# Altium schematic sheet 4_cyber60-smk_periferals.SchDoc: =ProjectTitle
size A4; Address1: github.com/4pplet/cyber60; Address2: Licence: CERN-OHL-S; SheetNumber: 5; SheetTotal: 5
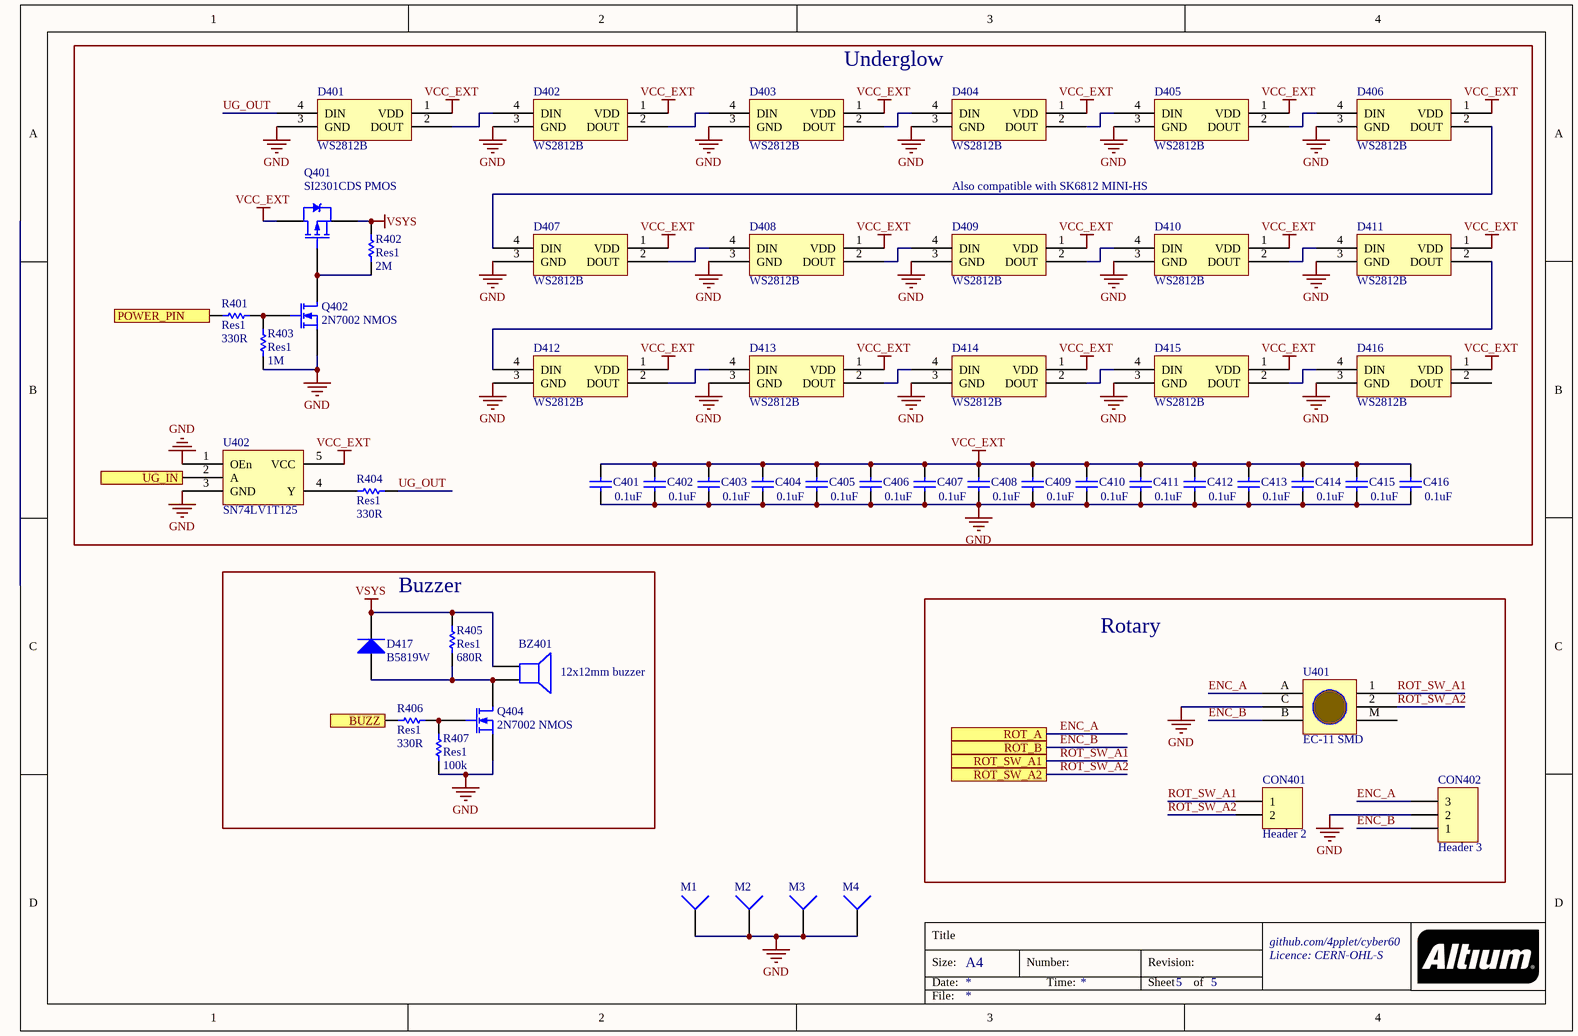
[diagram p0: 4_cyber60-smk_periferals.SchDoc]

## Parts
BZ401  12x12mm buzzer  [buzzer 12x12]
C401  value 0.1uF  [C0603[1608]]
C402  value 0.1uF  [C0603[1608]]
C403  value 0.1uF  [C0603[1608]]
C404  value 0.1uF  [C0603[1608]]
C405  value 0.1uF  [C0603[1608]]
C406  value 0.1uF  [C0603[1608]]
C407  value 0.1uF  [C0603[1608]]
C408  value 0.1uF  [C0603[1608]]
C409  value 0.1uF  [C0603[1608]]
C410  value 0.1uF  [C0603[1608]]
C411  value 0.1uF  [C0603[1608]]
C412  value 0.1uF  [C0603[1608]]
C413  value 0.1uF  [C0603[1608]]
C414  value 0.1uF  [C0603[1608]]
C415  value 0.1uF  [C0603[1608]]
C416  value 0.1uF  [C0603[1608]]
CON401  Header 2  [HDR1X2]  (no BOM)
CON402  Header 3  [HDR1X3]  (no BOM)
D401  WS2812B  [WS2812B - 2020]
D402  WS2812B  [WS2812B - 2020]
D403  WS2812B  [WS2812B - 2020]
D404  WS2812B  [WS2812B - 2020]
D405  WS2812B  [WS2812B - 2020]
D406  WS2812B  [WS2812B - 2020]
D407  WS2812B  [WS2812B - 2020]
D408  WS2812B  [WS2812B - 2020]
D409  WS2812B  [WS2812B - 2020]
D410  WS2812B  [WS2812B - 2020]
D411  WS2812B  [WS2812B - 2020]
D412  WS2812B  [WS2812B - 2020]
D413  WS2812B  [WS2812B - 2020]
D414  WS2812B  [WS2812B - 2020]
D415  WS2812B  [WS2812B - 2020]
D416  WS2812B  [WS2812B - 2020]
D417  B5819W  [SOD-123]
M1  Socket  [mounting_hole]  (value not drawn)  (no BOM)
M2  Socket  [mounting_hole]  (value not drawn)  (no BOM)
M3  Socket  [mounting_hole]  (value not drawn)  (no BOM)
M4  Socket  [mounting_hole]  (value not drawn)  (no BOM)
Q401  SI2301CDS PMOS  [SOT-23-3]
Q402  2N7002 NMOS  [SOT-23-3]
Q404  2N7002 NMOS  [SOT-23-3]
R401  Res1  value 330R  [R0603[1608]]
R402  Res1  value 2M  [R0603[1608]]
R403  Res1  value 1M  [R0603[1608]]
R404  Res1  value 330R  [R0603[1608]]
R405  Res1  value 680R  [R0603[1608]]
R406  Res1  value 330R  [R0603[1608]]
R407  Res1  value 100k  [R0603[1608]]
U401  EC-11 SMD  [EC11-SMD]
U402  SN74LV1T125  [SOT-23-5]

## Blocks framed on the sheet
Underglow: C401-C416 D401-D416 Q401 Q402 R401-R404 U402
Buzzer: BZ401 D417 Q404 R405-R407
Rotary: CON401 CON402 U401

## Ports
BUZZ, POWER_PIN, ROT_A, ROT_B, ROT_SW_A1, ROT_SW_A2, UG_IN

## Nets
GND: C401.1 C402.1 C403.1 C404.1 C405.1 C406.1 C407.1 C408.1 C409.1 C410.1 C411.1 C412.1 C413.1 C414.1 C415.1 C416.1 CON402.2 D401.3(GND) D402.3(GND) D403.3(GND) D404.3(GND) D405.3(GND) D406.3(GND) D407.3(GND) D408.3(GND) D409.3(GND) D410.3(GND) D411.3(GND) D412.3(GND) D413.3(GND) D414.3(GND) D415.3(GND) D416.3(GND) M1.1 M2.1 M3.1 M4.1 Q402.2(S) Q404.2(S) R403.2 R407.2 U401.C U402.1(OEn) U402.3(GND)
VCC_EXT: C401.2 C402.2 C403.2 C404.2 C405.2 C406.2 C407.2 C408.2 C409.2 C410.2 C411.2 C412.2 C413.2 C414.2 C415.2 C416.2 D401.1(VDD) D402.1(VDD) D403.1(VDD) D404.1(VDD) D405.1(VDD) D406.1(VDD) D407.1(VDD) D408.1(VDD) D409.1(VDD) D410.1(VDD) D411.1(VDD) D412.1(VDD) D413.1(VDD) D414.1(VDD) D415.1(VDD) D416.1(VDD) Q401.3(D) U402.5(VCC)
VSYS: BZ401.1 D417.2(K) Q401.2(S) R402.2 R405.1
BUZZ: R406.2 ; port BUZZ
ENC_A: CON402.3 U401.A(B) ; port ROT_A
ENC_B: CON402.1 U401.B ; port ROT_B
POWER_PIN: R401.1 ; port POWER_PIN
ROT_SW_A1: CON401.1 U401.1 ; port ROT_SW_A1
ROT_SW_A2: CON401.2 U401.2 ; port ROT_SW_A2
UG_IN: U402.2(A) ; port UG_IN
UG_OUT: D401.4(DIN) R404.1
NetBZ401_2: BZ401.2 D417.1(A) Q404.3(D) R405.2
NetD401_2: D401.2(DOUT) D402.4(DIN)
NetD402_2: D402.2(DOUT) D403.4(DIN)
NetD403_2: D403.2(DOUT) D404.4(DIN)
NetD404_2: D404.2(DOUT) D405.4(DIN)
NetD405_2: D405.2(DOUT) D406.4(DIN)
NetD406_2: D406.2(DOUT) D407.4(DIN)
NetD407_2: D407.2(DOUT) D408.4(DIN)
NetD408_2: D408.2(DOUT) D409.4(DIN)
NetD409_2: D409.2(DOUT) D410.4(DIN)
NetD410_2: D410.2(DOUT) D411.4(DIN)
NetD411_2: D411.2(DOUT) D412.4(DIN)
NetD412_2: D412.2(DOUT) D413.4(DIN)
NetD413_2: D413.2(DOUT) D414.4(DIN)
NetD414_2: D414.2(DOUT) D415.4(DIN)
NetD415_2: D415.2(DOUT) D416.4(DIN)
NetQ401_1: Q401.1(G) Q402.3(D) R402.1
NetQ402_1: Q402.1(G) R401.2 R403.1
NetQ404_1: Q404.1(G) R406.1 R407.1
NetR404_2: R404.2 U402.4(Y)

Not connected (* = marked no-connect by the designer): D416 2(DOUT); U401 M

## Notes on the sheet
- Also compatible with SK6812 MINI-HS
- Title
- Size:
- Date:
- A4
- Number:
- Time:
- Revision:
- Sheet
- of
- File:

## Library data of the parts
BZ401 = Speaker: Loudspeaker; MRF.Part: YS-SBZ1230; LCSC MFG: Fengming; LCSC Part #: C409829
C401-C416 = Cap: Capacitor; MRF.Part: CC0603KRX7R9BB104; MFG: KEMET; MFGPN: C0603C104M5RACTU; LCSC MFG: YAGEO; Version: 0603 imperial; LCSC Part #: C14663
CON401 = Header 2: Header, 2-Pin
CON402 = Header 3: Header, 3-Pin
D401-D416 = WS2812B: MRF.Part: WS2812C-2020; LCSC MFG: Worldsemi; LCSC Part #: C965556
D417 = Diode: Default Diode; LCSC MFG: Changjiang Electronics Tech (CJ); Version: SOD-123; LCSC Part #: C8598; MRF.Part: B5819W
Q401 = PMOS-2: P-Channel Power MOSFET; MRF.Part: SI2301CDS-T1-GE3; Note: Pin 4 not drawn and electrically connected to Pin 2.; LCSC MFG: Vishay Intertech; LCSC Part #: C10487
Q402 Q404 = MOSFET-N: N-Channel MOSFET; LCSC MFG: Changjiang Electronics Tech (CJ); LCSC Part #: C8545; MRF.Part: 2N7002
R401 R404 R406 = Res1: Resistor; MRF.Part: 0603WAF3300T5E; LCSC MFG: Uniroyal Elec; Version: 0603 imperial; LCSC Part #: C23138
R402 = Res1: Resistor; MRF.Part: 0603WAF2004T5E; LCSC MFG: Uniroyal Elec; Version: 0603 imperial; LCSC Part #: C22976
R403 = Res1: Resistor; MRF.Part: 0603WAF1004T5E; LCSC MFG: Uniroyal Elec; Version: 0603 imperial; LCSC Part #: C22935
R405 = Res1: Resistor; MRF.Part: 0603WAF6800T5E; LCSC MFG: Uniroyal Elec; Version: 0603 imperial; LCSC Part #: C23228
R407 = Res1: Resistor; MRF.Part: 0603WAF1003T5E; LCSC MFG: Uniroyal Elec; Version: 0603 imperial; LCSC Part #: C25803
U401 = EC-11
U402 = SN74LV1T125: SN74LV1T125 or SN74LV1T34. Connect OE to GND; MRF.Part: SN74LV1T125DBVR; LCSC MFG: Texas Instruments; LCSC Part #: C473338; Version: SOT-23
M1-M4 = Socket: LatestRevisionDate: 17-Jul-2002; LatestRevisionNote: Re-released for DXP Platform.; Publisher: Altium Limited